# EAGLE schematic esp_ikea_bekant_control (EAGLE 8.0.0)
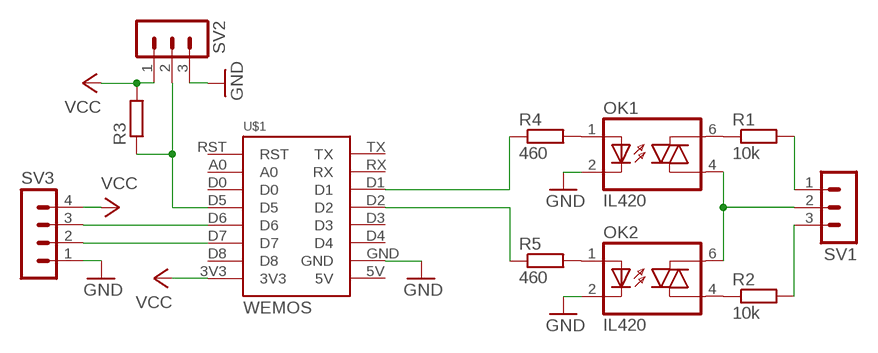
[diagram p0: schematic, sheet 1]

## Parts
OK1  IL420  [DIL06]
OK2  IL420  [DIL06]
R1  10k  R-EU_0204/7  [0204/7]
R2  10k  R-EU_0204/7  [0204/7]
R3  R-EU_0204/7  [0204/7]
R4  460  R-EU_0204/7  [0204/7]
R5  460  R-EU_0204/7  [0204/7]
SV1  MA03-1  [MA03-1]
SV2  MA03-1  [MA03-1]
SV3  MA04-1  [MA04-1]
U$1  WEMOS  [WEMOS]

## Nets
GND: OK1.2(C) OK2.2(C) SV2.3 SV3.1 U$1.GND
N$1: OK1.6(A2) R1.1
N$2: OK1.4(A1) OK2.6(A2) SV1.2
N$3: OK2.4(A1) R2.1
N$4: R1.2 SV1.1
N$5: R2.2 SV1.3
N$6: OK1.1(A) R4.2
N$7: OK2.1(A) R5.2
N$8: R4.1 U$1.D1
N$9: R5.1 U$1.D2
N$10: SV3.2 U$1.D7
N$11: SV3.3 U$1.D6
N$12: R3.1 SV2.2 U$1.D5
VCC: R3.2 SV2.1 SV3.4 U$1.3V3
Unconnected: U$1.5V U$1.A0 U$1.D0 U$1.D3 U$1.D4 U$1.D8 U$1.RST U$1.RX U$1.TX

## Library data of the parts
OK1 OK2 = optocoupler:IL420: SIEMENS OPTO COUPLER; MF: VISHAY/TELEFUNKEN; MPN: IL420; OC_FARNELL: 1469561; OC_NEWARK: 58K1719
R1-R5 = resistor:R-EU_: RESISTOR, European symbol
SV1 SV2 = con-lstb:MA03-1: PIN HEADER; OC_FARNELL: unknown; OC_NEWARK: unknown
SV3 = con-lstb:MA04-1: PIN HEADER; OC_FARNELL: unknown; OC_NEWARK: unknown
U$1 = 1455413453956-wemos:WEMOS